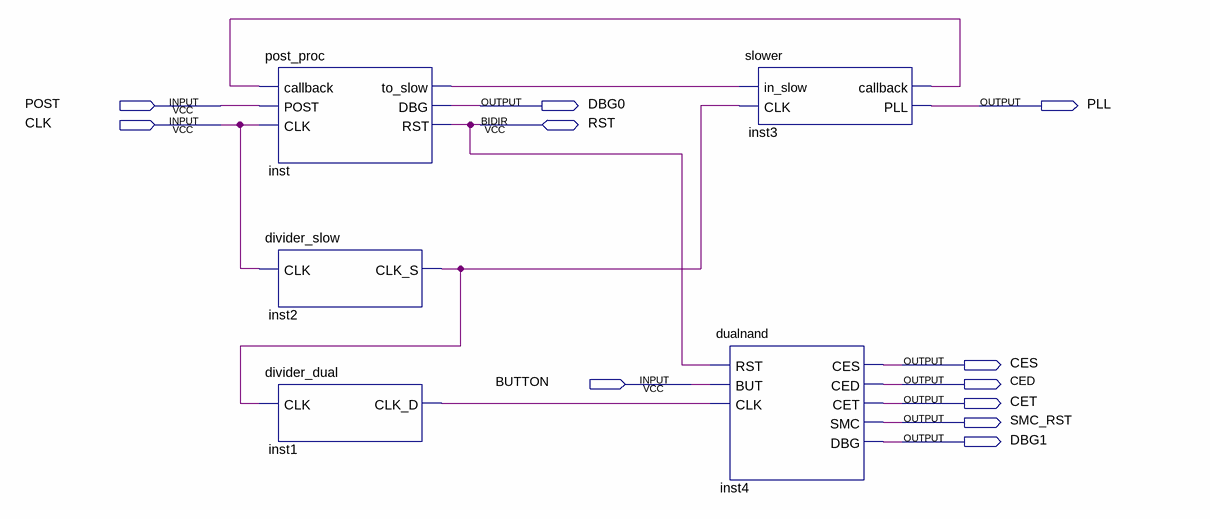
[diagram p0: schematic sheet]
// Quartus schematic glitchChip_DualNAND.bdf as structural Verilog: 5 symbols, 11 pins
module glitchChip_DualNAND (
  input  POST,
  input  CLK,
  input  BUTTON,
  inout  RST,
  output DBG0,
  output PLL,
  output CES,
  output CED,
  output CET,
  output SMC_RST,
  output DBG1
);

  wire inst1_clk_d, inst2_clk_s, inst3_callback, inst_to_slow;

  post_proc inst (.callback(inst3_callback), .POST(POST), .CLK(CLK), .to_slow(inst_to_slow), .DBG(DBG0), .RST(RST));
  divider_slow inst2 (.CLK(CLK), .CLK_S(inst2_clk_s));
  divider_dual inst1 (.CLK(inst2_clk_s), .CLK_D(inst1_clk_d));
  dualnand inst4 (
    .RST(RST), .BUT(BUTTON), .CLK(inst1_clk_d), .CES(CES), .CED(CED), .CET(CET), .SMC(SMC_RST), .DBG(DBG1));
  slower inst3 (.in_slow(inst_to_slow), .CLK(inst2_clk_s), .callback(inst3_callback), .PLL(PLL));
endmodule
